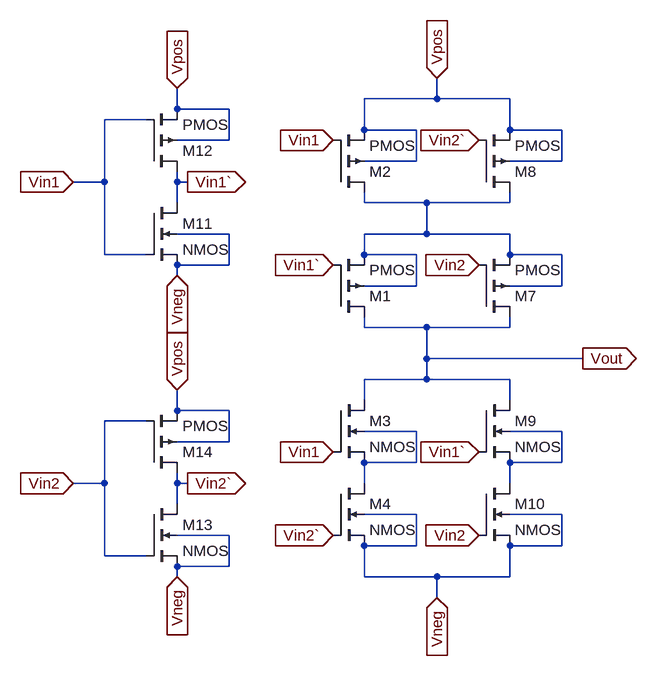
[diagram p0: schematic XNOR_SYM.asc]
XNOR_SYM.asc, the LTspice schematic file:
Version 4
SHEET 1 880 756
WIRE 384 -128 384 -160
WIRE 384 -128 272 -128
WIRE 496 -128 384 -128
WIRE -16 -112 -16 -144
WIRE 64 -112 -16 -112
WIRE -64 -96 -128 -96
WIRE 272 -80 272 -128
WIRE 352 -80 272 -80
WIRE 496 -80 496 -128
WIRE 576 -80 496 -80
WIRE 64 -64 64 -112
WIRE 64 -64 -16 -64
WIRE 352 -32 352 -80
WIRE 352 -32 272 -32
WIRE 576 -32 576 -80
WIRE 576 -32 496 -32
WIRE -128 0 -128 -96
WIRE -128 0 -176 0
WIRE -16 0 -16 -16
WIRE 0 0 -16 0
WIRE -16 32 -16 0
WIRE 272 32 272 16
WIRE 368 32 272 32
WIRE 496 32 496 16
WIRE 496 32 368 32
WIRE 64 80 -16 80
WIRE 368 80 368 32
WIRE 368 80 272 80
WIRE 496 80 368 80
WIRE -128 112 -128 0
WIRE -64 112 -128 112
WIRE 272 112 272 80
WIRE 352 112 272 112
WIRE 496 112 496 80
WIRE 576 112 496 112
WIRE 64 128 64 80
WIRE 64 128 -16 128
WIRE -16 144 -16 128
WIRE 352 160 352 112
WIRE 352 160 272 160
WIRE 576 160 576 112
WIRE 576 160 496 160
WIRE 272 224 272 208
WIRE 368 224 272 224
WIRE 496 224 496 208
WIRE 496 224 368 224
WIRE 368 272 368 224
WIRE 608 272 368 272
WIRE 368 304 368 272
WIRE 368 304 272 304
WIRE 496 304 368 304
WIRE 272 336 272 304
WIRE 496 336 496 304
WIRE -16 352 -16 320
WIRE 64 352 -16 352
WIRE -64 368 -128 368
WIRE 352 384 272 384
WIRE 576 384 496 384
WIRE 64 400 64 352
WIRE 64 400 -16 400
WIRE 352 432 352 384
WIRE 352 432 272 432
WIRE 576 432 576 384
WIRE 576 432 496 432
WIRE -128 464 -128 368
WIRE -128 464 -176 464
WIRE -16 464 -16 448
WIRE 0 464 -16 464
WIRE 272 464 272 432
WIRE 496 464 496 432
WIRE -16 496 -16 464
WIRE 352 512 272 512
WIRE 576 512 496 512
WIRE 64 544 -16 544
WIRE 352 560 352 512
WIRE 352 560 272 560
WIRE 576 560 576 512
WIRE 576 560 496 560
WIRE -128 576 -128 464
WIRE -64 576 -128 576
WIRE 64 592 64 544
WIRE 64 592 -16 592
WIRE -16 608 -16 592
WIRE 272 608 272 560
WIRE 384 608 272 608
WIRE 496 608 496 560
WIRE 496 608 384 608
WIRE 384 640 384 608
FLAG 384 -160 Vpos
IOPIN 384 -160 In
FLAG -176 0 Vin1
IOPIN -176 0 In
FLAG 224 416 Vin1
IOPIN 224 416 In
FLAG -176 464 Vin2
IOPIN -176 464 In
FLAG 384 640 Vneg
IOPIN 384 640 In
FLAG 608 272 Vout
IOPIN 608 272 Out
FLAG 224 -64 Vin1
IOPIN 224 -64 In
FLAG -16 -144 Vpos
IOPIN -16 -144 In
FLAG -16 144 Vneg
IOPIN -16 144 In
FLAG 0 0 Vin1`
IOPIN 0 0 Out
FLAG -16 320 Vpos
IOPIN -16 320 In
FLAG -16 608 Vneg
IOPIN -16 608 In
FLAG 0 464 Vin2`
IOPIN 0 464 Out
FLAG 448 128 Vin2
IOPIN 448 128 In
FLAG 448 -64 Vin2`
IOPIN 448 -64 In
FLAG 224 128 Vin1`
IOPIN 224 128 In
FLAG 448 416 Vin1`
IOPIN 448 416 In
FLAG 224 544 Vin2`
IOPIN 224 544 In
FLAG 448 544 Vin2
IOPIN 448 544 In
SYMBOL pmos4 224 208 M180
SYMATTR InstName M1
SYMBOL pmos4 224 16 M180
SYMATTR InstName M2
SYMBOL nmos4 224 336 R0
SYMATTR InstName M3
SYMBOL nmos4 224 464 R0
SYMATTR InstName M4
SYMBOL pmos4 448 208 M180
SYMATTR InstName M7
SYMBOL pmos4 448 16 M180
SYMATTR InstName M8
SYMBOL nmos4 448 336 R0
SYMATTR InstName M9
SYMBOL nmos4 448 464 R0
SYMATTR InstName M10
SYMBOL nmos4 -64 32 R0
SYMATTR InstName M11
SYMBOL pmos4 -64 -16 M180
SYMATTR InstName M12
SYMBOL nmos4 -64 496 R0
SYMATTR InstName M13
SYMBOL pmos4 -64 448 M180
SYMATTR InstName M14

The netlist it stands for:
* XNOR_SYM.asc
M1 Vout Vin1` N001 N001 PMOS
M2 N001 Vin1 Vpos Vpos PMOS
M3 Vout Vin1 N002 N002 NMOS
M4 N002 Vin2` Vneg Vneg NMOS
M7 Vout Vin2 N001 N001 PMOS
M8 N001 Vin2` Vpos Vpos PMOS
M9 Vout Vin1` N003 N003 NMOS
M10 N003 Vin2 Vneg Vneg NMOS
M11 Vin1` Vin1 Vneg Vneg NMOS
M12 Vin1` Vin1 Vpos Vpos PMOS
M13 Vin2` Vin2 Vneg Vneg NMOS
M14 Vin2` Vin2 Vpos Vpos PMOS
.model NMOS NMOS
.model PMOS PMOS
.lib standard.mos
.backanno
.end